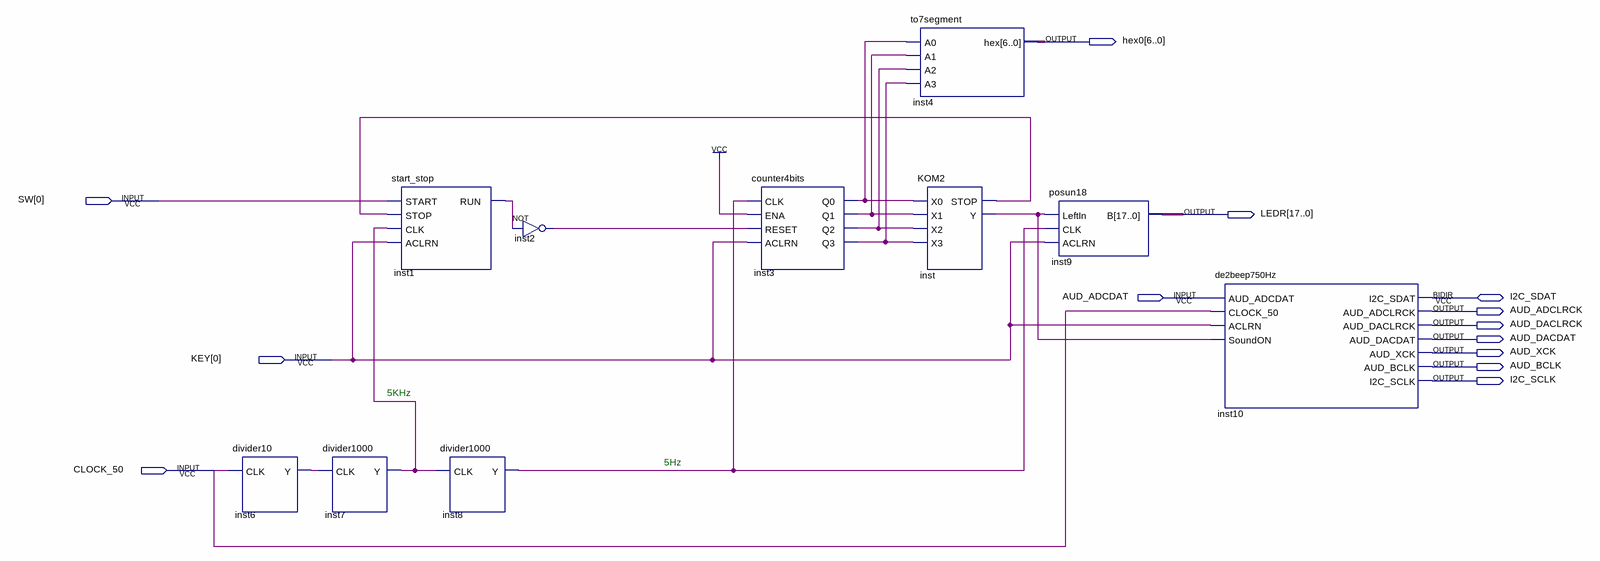
[diagram p0: schematic sheet]
// Quartus schematic majakEA.bdf as structural Verilog: 10 symbols, 13 pins
module majakEA (
  input  [0:0] SW,
  input  AUD_ADCDAT,
  input  [0:0] KEY,
  input  CLOCK_50,
  inout  I2C_SDAT,
  output [6:0] hex0,
  output [17:0] LEDR,
  output AUD_ADCLRCK,
  output AUD_DACLRCK,
  output AUD_DACDAT,
  output AUD_XCK,
  output AUD_BCLK,
  output I2C_SCLK
);

  wire inst1_run, inst2_out, inst3_q0, inst3_q1, inst3_q2, inst3_q3, inst6_y, inst7_y, inst8_y, inst_stop,
       inst_y;

  divider10 inst6 (.CLK(CLOCK_50), .Y(inst6_y));
  divider1000 inst7 (.CLK(inst6_y), .Y(inst7_y));
  start_stop inst1 (.START(SW[0]), .STOP(inst_stop), .CLK(inst7_y), .ACLRN(KEY[0]), .RUN(inst1_run));
  divider1000 inst8 (.CLK(inst7_y), .Y(inst8_y));
  not inst2 (inst2_out, inst1_run);
  counter4bits inst3 (
    .CLK(inst8_y), .ENA(1'b1), .RESET(inst2_out), .ACLRN(KEY[0]), .Q0(inst3_q0), .Q1(inst3_q1),
    .Q2(inst3_q2), .Q3(inst3_q3));
  to7segment inst4 (.A0(inst3_q0), .A1(inst3_q1), .A2(inst3_q2), .A3(inst3_q3), .hex(hex0));
  KOM2 inst (.X0(inst3_q0), .X1(inst3_q1), .X2(inst3_q2), .X3(inst3_q3), .STOP(inst_stop), .Y(inst_y));
  posun18 inst9 (.LeftIn(inst_y), .CLK(inst8_y), .ACLRN(KEY[0]), .B(LEDR));
  de2beep750Hz inst10 (
    .AUD_ADCDAT(AUD_ADCDAT), .CLOCK_50(CLOCK_50), .ACLRN(KEY[0]), .SoundON(inst_y),
    .AUD_ADCLRCK(AUD_ADCLRCK), .AUD_DACLRCK(AUD_DACLRCK), .AUD_DACDAT(AUD_DACDAT), .AUD_XCK(AUD_XCK),
    .AUD_BCLK(AUD_BCLK), .I2C_SCLK(I2C_SCLK), .I2C_SDAT(I2C_SDAT));

  // Notes on the sheet:
  //   5KHz
  //   5Hz
endmodule
